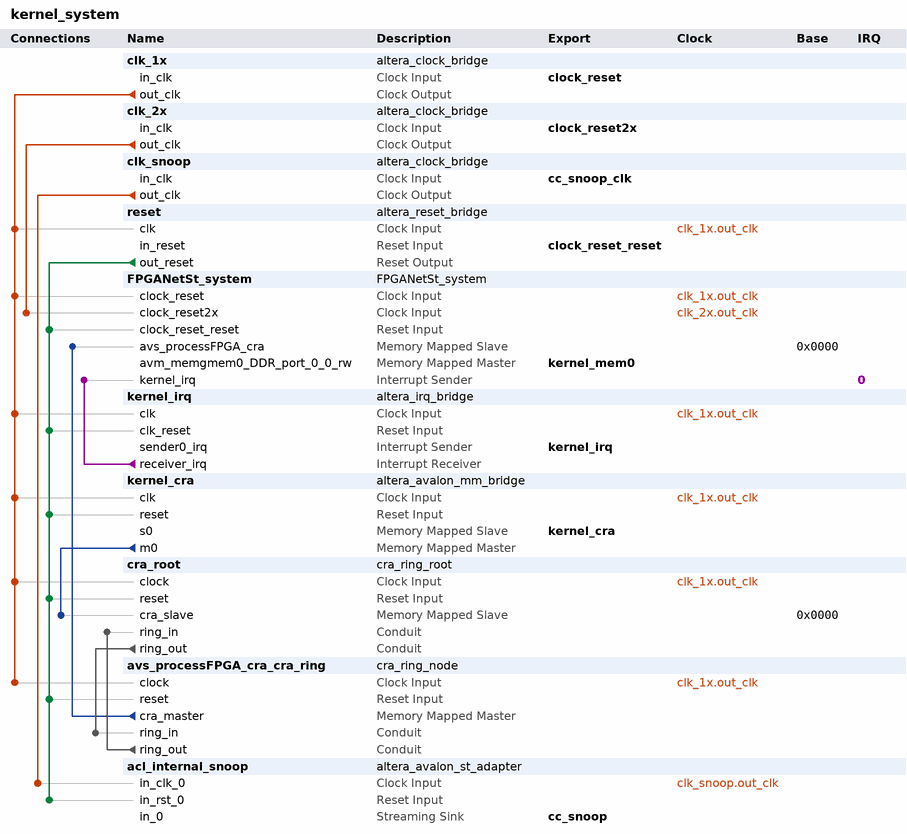
[diagram p0: system contents]
# Platform Designer (Qsys) system kernel_system, Cyclone V 5CGXFC3B6F23C6
# Parameters at their usual value, and those the tool derives, are not listed.
package require -exact qsys 18.1
create_system kernel_system
set_project_property DEVICE_FAMILY {Cyclone V}
set_project_property DEVICE 5CGXFC3B6F23C6

add_instance clk_1x altera_clock_bridge 18.1
set_instance_parameter_value clk_1x DERIVED_CLOCK_RATE 0
set_instance_parameter_value clk_1x EXPLICIT_CLOCK_RATE 0

add_instance clk_2x altera_clock_bridge 18.1
set_instance_parameter_value clk_2x DERIVED_CLOCK_RATE 0
set_instance_parameter_value clk_2x EXPLICIT_CLOCK_RATE 0

add_instance clk_snoop altera_clock_bridge 18.1
set_instance_parameter_value clk_snoop DERIVED_CLOCK_RATE 0
set_instance_parameter_value clk_snoop EXPLICIT_CLOCK_RATE 0

add_instance reset altera_reset_bridge 18.1
set_instance_parameter_value reset ACTIVE_LOW_RESET 1
set_instance_parameter_value reset SYNCHRONOUS_EDGES deassert

add_instance FPGANetSt_system FPGANetSt_system 14.0

add_instance kernel_irq altera_irq_bridge 18.1
set_instance_parameter_value kernel_irq IRQ_WIDTH 1

add_instance kernel_cra altera_avalon_mm_bridge 18.1
set_instance_parameter_value kernel_cra ADDRESS_UNITS SYMBOLS
set_instance_parameter_value kernel_cra ADDRESS_WIDTH 30
set_instance_parameter_value kernel_cra DATA_WIDTH 64
set_instance_parameter_value kernel_cra MAX_PENDING_RESPONSES 1
set_instance_parameter_value kernel_cra PIPELINE_COMMAND 0
set_instance_parameter_value kernel_cra PIPELINE_RESPONSE 0
set_instance_parameter_value kernel_cra USE_AUTO_ADDRESS_WIDTH 0

add_instance cra_root cra_ring_root 1.0
set_instance_parameter_value cra_root ADDR_W 5
set_instance_parameter_value cra_root ASYNC_RESET 1
set_instance_parameter_value cra_root DATA_W 64
set_instance_parameter_value cra_root ID_W 0
set_instance_parameter_value cra_root ROM_ENABLE 0
set_instance_parameter_value cra_root ROM_EXT_W 0
set_instance_parameter_value cra_root SYNCHRONIZE_RESET 0

add_instance avs_processFPGA_cra_cra_ring cra_ring_node 1.0
set_instance_parameter_value avs_processFPGA_cra_cra_ring ASYNC_RESET 1
set_instance_parameter_value avs_processFPGA_cra_cra_ring CRA_ADDR_W 5
set_instance_parameter_value avs_processFPGA_cra_cra_ring DATA_W 64
set_instance_parameter_value avs_processFPGA_cra_cra_ring ID 0
set_instance_parameter_value avs_processFPGA_cra_cra_ring ID_W 0
set_instance_parameter_value avs_processFPGA_cra_cra_ring RING_ADDR_W 5
set_instance_parameter_value avs_processFPGA_cra_cra_ring SYNCHRONIZE_RESET 0

add_instance acl_internal_snoop altera_avalon_st_adapter 18.1
set_instance_parameter_value acl_internal_snoop inBitsPerSymbol 31
set_instance_parameter_value acl_internal_snoop inChannelWidth 0
set_instance_parameter_value acl_internal_snoop inDataWidth 31
set_instance_parameter_value acl_internal_snoop inErrorWidth 0
set_instance_parameter_value acl_internal_snoop inMaxChannel 0
set_instance_parameter_value acl_internal_snoop inReadyLatency 0
set_instance_parameter_value acl_internal_snoop inUseEmptyPort 0
set_instance_parameter_value acl_internal_snoop inUsePackets 0
set_instance_parameter_value acl_internal_snoop inUseReady 1
set_instance_parameter_value acl_internal_snoop inUseValid 1
set_instance_parameter_value acl_internal_snoop outChannelWidth 0
set_instance_parameter_value acl_internal_snoop outDataWidth 31
set_instance_parameter_value acl_internal_snoop outErrorWidth 0
set_instance_parameter_value acl_internal_snoop outMaxChannel 0
set_instance_parameter_value acl_internal_snoop outReadyLatency 0
set_instance_parameter_value acl_internal_snoop outUseEmptyPort 0
set_instance_parameter_value acl_internal_snoop outUseReady 1
set_instance_parameter_value acl_internal_snoop outUseValid 1

# connections
add_connection clk_1x.out_clk avs_processFPGA_cra_cra_ring.clock clock
add_connection clk_1x.out_clk cra_root.clock clock
add_connection clk_1x.out_clk FPGANetSt_system.clock_reset clock
add_connection clk_1x.out_clk kernel_cra.clk clock
add_connection clk_1x.out_clk kernel_irq.clk clock
add_connection clk_1x.out_clk reset.clk clock
add_connection clk_2x.out_clk FPGANetSt_system.clock_reset2x clock
add_connection clk_snoop.out_clk acl_internal_snoop.in_clk_0 clock
add_connection reset.out_reset acl_internal_snoop.in_rst_0 reset
add_connection reset.out_reset avs_processFPGA_cra_cra_ring.reset reset
add_connection reset.out_reset cra_root.reset reset
add_connection reset.out_reset FPGANetSt_system.clock_reset_reset reset
add_connection reset.out_reset kernel_cra.reset reset
add_connection reset.out_reset kernel_irq.clk_reset reset
add_connection avs_processFPGA_cra_cra_ring.cra_master FPGANetSt_system.avs_processFPGA_cra avalon
set_connection_parameter_value avs_processFPGA_cra_cra_ring.cra_master/FPGANetSt_system.avs_processFPGA_cra baseAddress 0x0000
add_connection kernel_cra.m0 cra_root.cra_slave avalon
set_connection_parameter_value kernel_cra.m0/cra_root.cra_slave baseAddress 0x0000
add_connection avs_processFPGA_cra_cra_ring.ring_out cra_root.ring_in conduit
add_connection cra_root.ring_out avs_processFPGA_cra_cra_ring.ring_in conduit
add_connection kernel_irq.receiver_irq FPGANetSt_system.kernel_irq interrupt
set_connection_parameter_value kernel_irq.receiver_irq/FPGANetSt_system.kernel_irq irqNumber 0

# exported interfaces
add_interface cc_snoop avalon_streaming sink
set_interface_property cc_snoop EXPORT_OF acl_internal_snoop.in_0
add_interface cc_snoop_clk clock sink
set_interface_property cc_snoop_clk EXPORT_OF clk_snoop.in_clk
add_interface clock_reset clock sink
set_interface_property clock_reset EXPORT_OF clk_1x.in_clk
add_interface clock_reset2x clock sink
set_interface_property clock_reset2x EXPORT_OF clk_2x.in_clk
add_interface clock_reset_reset reset sink
set_interface_property clock_reset_reset EXPORT_OF reset.in_reset
add_interface kernel_cra avalon slave
set_interface_property kernel_cra EXPORT_OF kernel_cra.s0
add_interface kernel_irq interrupt sender
set_interface_property kernel_irq EXPORT_OF kernel_irq.sender0_irq
add_interface kernel_mem0 avalon master
set_interface_property kernel_mem0 EXPORT_OF FPGANetSt_system.avm_memgmem0_DDR_port_0_0_rw

set_interconnect_requirement {$system} qsys_mm.clockCrossingAdapter HANDSHAKE
set_interconnect_requirement {$system} qsys_mm.maxAdditionalLatency 0

save_system kernel_system.qsys
